# Altium schematic sheet Logic_SE.SchDoc
size A
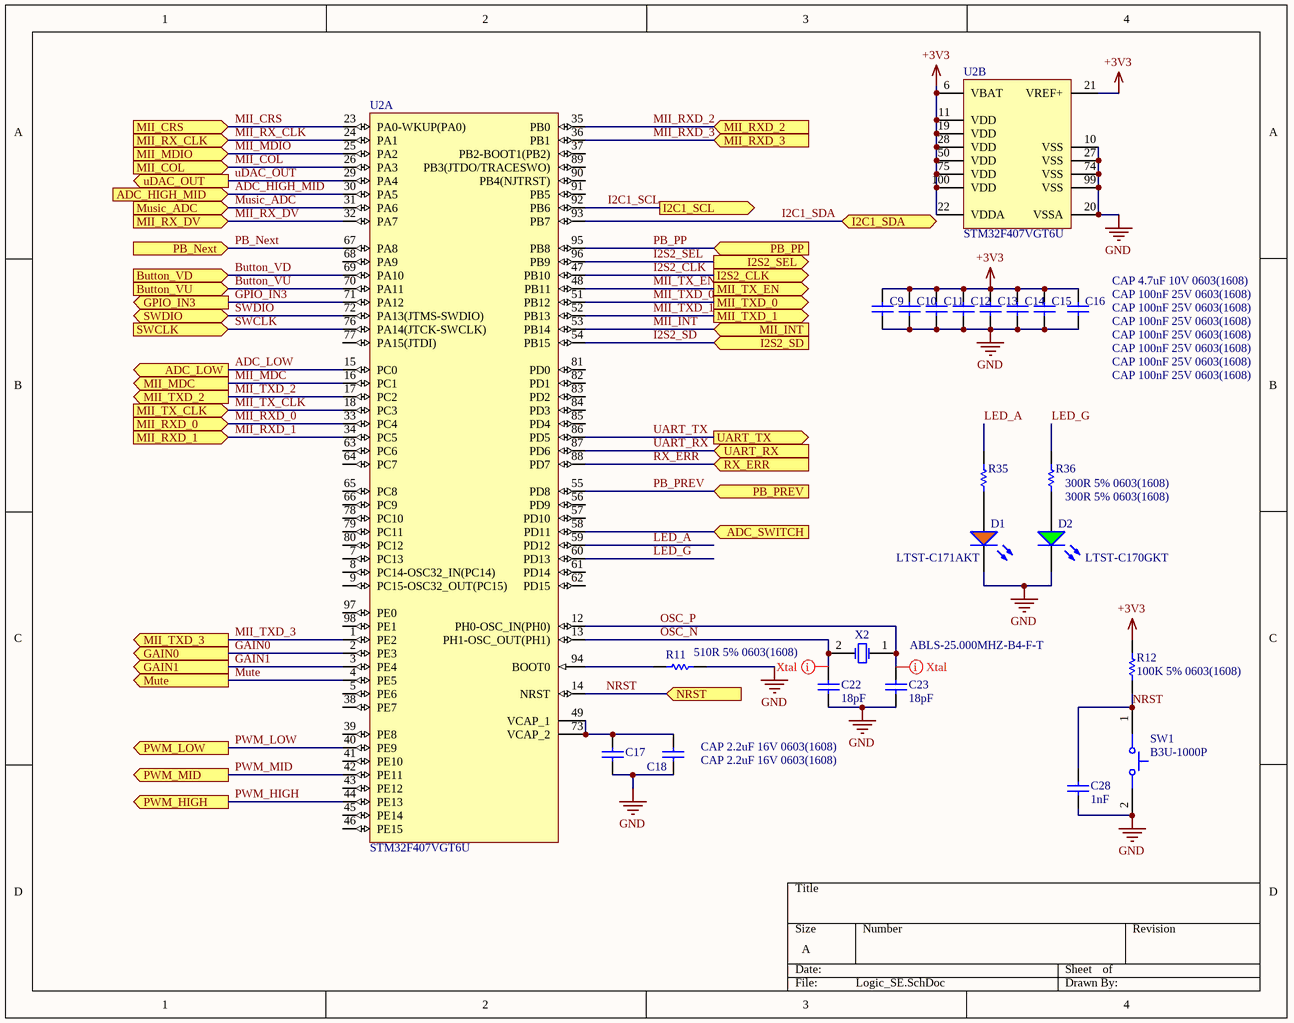
[diagram p0: Logic_SE.SchDoc]

## Parts
C9  CAP 100nF 25V 0603(1608)  [CAPC0603(1608)100_N]
C10  CAP 100nF 25V 0603(1608)  [CAPC0603(1608)100_N]
C11  CAP 100nF 25V 0603(1608)  [CAPC0603(1608)100_N]
C12  CAP 100nF 25V 0603(1608)  [CAPC0603(1608)100_N]
C13  CAP 100nF 25V 0603(1608)  [CAPC0603(1608)100_N]
C14  CAP 100nF 25V 0603(1608)  [CAPC0603(1608)100_N]
C15  CAP 100nF 25V 0603(1608)  [CAPC0603(1608)100_N]
C16  CAP 4.7uF 10V 0603(1608)  [CAPC0603(1608)100_M]
C17  CAP 2.2uF 16V 0603(1608)  [CAPC0603(1608)55_L]
C18  CAP 2.2uF 16V 0603(1608)  [CAPC0603(1608)55_L]
C22  18pF  [CAPC0603(1608)100_L]
C23  18pF  [CAPC0603(1608)100_L]
C28  1nF  [CAPC0603(1608)100_L]
D1  LTST-C171AKT  [LTST-C171AKT_V]
D2  LTST-C170GKT  [LTST-C170GKT_V]
R11  510R 5% 0603(1608)  [RESC0603(1608)_L]
R12  100K 5% 0603(1608)  [RESC0603(1608)_N]
R35  300R 5% 0603(1608)  [RESC0603(1608)_N]
R36  300R 5% 0603(1608)  [RESC0603(1608)_N]
SW1  B3U-1000P  [OMRON-B3U-1000_V]
U2  STM32F407VGT6U  [STM-LQFP100_V]  (parts A,B of 2)
X2  ABLS-25.000MHZ-B4-F-T  [ABRA-ABLS2-2_V]

## Ports
ADC_HIGH_MID (in), ADC_LOW (out), ADC_SWITCH (in), Button_VD (in), Button_VU (in), GAIN0 (out), GAIN1 (out), GPIO_IN3 (out), I2C1_SCL (out), I2C1_SDA (bidir), I2S2_CLK (out), I2S2_SD (in), I2S2_SEL (out), MII_COL (in), MII_CRS (in), MII_INT (in), MII_MDC (out), MII_MDIO (in), MII_RX_CLK (in), MII_RX_DV (in), MII_RXD_0 (in), MII_RXD_1 (in), MII_RXD_2 (in), MII_RXD_3 (in), MII_TX_CLK (in), MII_TX_EN (out), MII_TXD_0 (out), MII_TXD_1 (out), MII_TXD_2 (out), MII_TXD_3 (out), Music_ADC (in), Mute (out), NRST (in), PB_Next (in), PB_PP (in), PB_PREV (in), PWM_HIGH (out), PWM_LOW (out), PWM_MID (out), RX_ERR (in), SWCLK (in), SWDIO (bidir), UART_RX (in), UART_TX (out), uDAC_OUT (out)

## Nets
+3V3: C9.2 C10.2 C11.2 C12.2 C13.2 C14.2 C15.2 C16.2 R12.2 U2.6(VBAT) U2.11(VDD) U2.19(VDD) U2.21(VREF+) U2.22(VDDA) U2.28(VDD) U2.50(VDD) U2.75(VDD) U2.100(VDD)
GND: C9.1 C10.1 C11.1 C12.1 C13.1 C14.1 C15.1 C16.1 C17.1 C18.1 C22.1 C23.1 C28.1 D1.C D2.C R11.2 SW1.2 U2.10(VSS) U2.20(VSSA) U2.27(VSS) U2.74(VSS) U2.99(VSS)
ADC_HIGH_MID: U2.30(PA5) ; port ADC_HIGH_MID
ADC_LOW: U2.15(PC0) ; port ADC_LOW
ADC_SWITCH: U2.58(PD11) ; port ADC_SWITCH
Button_VD: U2.69(PA10) ; port Button_VD
Button_VU: U2.70(PA11) ; port Button_VU
GAIN0: U2.2(PE3) ; port GAIN0
GAIN1: U2.3(PE4) ; port GAIN1
GPIO_IN3: U2.71(PA12) ; port GPIO_IN3
I2C1_SCL: U2.92(PB6) ; port I2C1_SCL
I2C1_SDA: U2.93(PB7) ; port I2C1_SDA
I2S2_CLK: U2.47(PB10) ; port I2S2_CLK
I2S2_SD: U2.54(PB15) ; port I2S2_SD
I2S2_SEL: U2.96(PB9) ; port I2S2_SEL
LED_A: R35.2 U2.59(PD12)
LED_G: R36.2 U2.60(PD13)
MII_COL: U2.26(PA3) ; port MII_COL
MII_CRS: U2.23(PA0-WKUP(PA0)) ; port MII_CRS
MII_INT: U2.53(PB14) ; port MII_INT
MII_MDC: U2.16(PC1) ; port MII_MDC
MII_MDIO: U2.25(PA2) ; port MII_MDIO
MII_RX_CLK: U2.24(PA1) ; port MII_RX_CLK
MII_RX_DV: U2.32(PA7) ; port MII_RX_DV
MII_RXD_0: U2.33(PC4) ; port MII_RXD_0
MII_RXD_1: U2.34(PC5) ; port MII_RXD_1
MII_RXD_2: U2.35(PB0) ; port MII_RXD_2
MII_RXD_3: U2.36(PB1) ; port MII_RXD_3
MII_TX_CLK: U2.18(PC3) ; port MII_TX_CLK
MII_TX_EN: U2.48(PB11) ; port MII_TX_EN
MII_TXD_0: U2.51(PB12) ; port MII_TXD_0
MII_TXD_1: U2.52(PB13) ; port MII_TXD_1
MII_TXD_2: U2.17(PC2) ; port MII_TXD_2
MII_TXD_3: U2.1(PE2) ; port MII_TXD_3
Music_ADC: U2.31(PA6) ; port Music_ADC
Mute: U2.4(PE5) ; port Mute
NRST: C28.2 R12.1 SW1.1 U2.14(NRST) ; port NRST
OSC_N: C22.2 U2.13(PH1-OSC_OUT(PH1)) X2.2(X2)
OSC_P: C23.2 U2.12(PH0-OSC_IN(PH0)) X2.1(X1)
PB_Next: U2.67(PA8) ; port PB_Next
PB_PP: U2.95(PB8) ; port PB_PP
PB_PREV: U2.55(PD8) ; port PB_PREV
PWM_HIGH: U2.44(PE13) ; port PWM_HIGH
PWM_LOW: U2.40(PE9) ; port PWM_LOW
PWM_MID: U2.42(PE11) ; port PWM_MID
RX_ERR: U2.88(PD7) ; port RX_ERR
SWCLK: U2.76(PA14(JTCK-SWCLK)) ; port SWCLK
SWDIO: U2.72(PA13(JTMS-SWDIO)) ; port SWDIO
UART_RX: U2.87(PD6) ; port UART_RX
UART_TX: U2.86(PD5) ; port UART_TX
uDAC_OUT: U2.29(PA4) ; port uDAC_OUT
NetC17_2: C17.2 C18.2 U2.49(VCAP_1) U2.73(VCAP_2)
NetD1_A: D1.A R35.1
NetD2_A: D2.A R36.1
NetR11_1: R11.1 U2.94(BOOT0)

Not connected (* = marked no-connect by the designer): U2 5(PE6) 7(PC13) 8(PC14-OSC32_IN(PC14)) 9(PC15-OSC32_OUT(PC15)) 37(PB2-BOOT1(PB2)) 38(PE7) 39(PE8) 41(PE10) 43(PE12) 45(PE14) 46(PE15) 56(PD9) 57(PD10) 61(PD14) 62(PD15) 63(PC6) 64(PC7) 65(PC8) 66(PC9) 68(PA9) 77(PA15(JTDI)) 78(PC10) 79(PC11) 80(PC12) 81(PD0) 82(PD1) 83(PD2) 84(PD3) 85(PD4) 89(PB3(JTDO/TRACESWO)) 90(PB4(NJTRST)) 91(PB5) 97(PE0) 98(PE1)

## Layout directives
net class Xtal: OSC_N, OSC_P

## Library data of the parts
C9-C15 = CMP-1035-02589-1: CAP 100nF 25V ±20% 0603 (1608 Metric) Thickness 1mm SMD; Case-EIA: 0603; Tolerance: Â±20%; Case-Metric: 1608; Value: 100nF; Max Thickness: 1 mm; Technology: SMT; Rated Voltage: 25 V
C16 = CMP-1035-02787-1: CAP 4.7uF 10V ±20% 0603 (1608 Metric) Thickness 1mm SMD; Case-EIA: 0603; Case-Metric: 1608; Tolerance: Â±20%; Value: 4.7uF; Max Thickness: 1 mm; Technology: SMT; Rated Voltage: 10 V
C17 C18 = CMP-1035-02764-1: CAP 2.2uF 16V ±20% 0603 (1608 Metric) Thickness 0.55mm SMD; Tolerance: Â±20%; Case-Metric: 1608; Case-EIA: 0603; Value: 2.2uF; Rated Voltage: 16 V; Max Thickness: 0.55 mm; Technology: SMT
C22 C23 C28 = CMP-1590-00005-1: 0603 (1608 Metric) Chip Capacitor; Case-Metric: 1608; Case-EIA: 0603; PackageReference: CAPC0603(1608)100
D1 = CMP-1674-00004-3: LED AMBER CLR THIN 0805 SMD; Manufacturer: Lite-On; PartNumber: LTST-C171AKT; ComponentLink1URL: http://optoelectronics.liteon.com/upload/download/DS-22-99-0170/S_110_LTST-C171AKT.pdf; PackageReference: C171AKT; ComponentLink1Description: Datasheet
D2 = CMP-1674-00002-2: LED GREEN CLEAR 0805 SMD; ComponentLink1Description: Datasheet; PackageReference: C170GKT; ComponentLink1URL: http://media.digikey.com/pdf/Data%20Sheets/Lite-On%20PDFs/LTST-C170GKT.pdf; PartNumber: LTST-C170GKT
R11 = CMP-1012-00067-1: 510R 0.1W 5% 0603 (1608 Metric)  SMD; Case-EIA: 0603; Value: 510.00 Ohm; Case-Metric: 1608; Technology: SMT; Power: 0.1 W; Tolerance: 5 %
R12 R35 R36 = CMP-1012-00122-1: 100K 0.1W 5% 0603 (1608 Metric)  SMD; Case-EIA: 0603; Value: 100000.00 Ohm; Case-Metric: 1608; Tolerance: 5 %; Power: 0.1 W; Technology: SMT
SW1 = CMP-2100-03586-1: Ultra-Small Tactile Switch, 0.05 A, 12 V, -25 to 70 degC, 2-Pin SMD, RoHS, Tape and Reel; Manufacturer: Omron Electronic Components; Operating Force: 1.5N; Current Rating: 50mA; Voltage Rating (DC): 12V; Electrical Life: 200000Cycles; Actuator Length: 0.4mm; Insulation Resistance: 100MOhm; Switch Travel: 0.15mm; Throw Configuration: SPST; Illumination Type: Illuminated; Width: 3mm; Weight: 0.022g; Datasheet Version: 42005.0; Datasheet URL: http://www.omron.com/ecb/products/pdf/en-b3u.pdf; Height: 1.2mm; Package Quantity: 1; REACH SVHC: Unknown; Contact Current Rating: 50mA; Contact Material: Silver; Max Current Rating: 50mA; Package Reference: B3U-1000; Termination: SMD/SMT; Packaging: TapeandReel; Manufacturer URL: http://www.omron.com/; RoHSCompliant: true; Mount: SurfaceMount; Length: 4mm; Min Operating Temperature: -25degC; Depth: 2.5mm; Lead Free: LeadFree; Case/Package: SMD/SMT; Package Description: 2-Pin Surface Mount Device, Body 3 x 2.5 mm; Max Operating Temperature: 70degC; Orientation: Straight
U2 = CMP-0243-00032-2: ARM Cortex-M4 32-bit MCU+FPU, 210 DMIPS, 1024 kB Flash, 192 kB Internal RAM, 82 I/Os, 100-pin LQFP, -40 to 85 degC, Tray; Manufacturer: STMicroelectronics; D/A Converter: 2x12-bit; Supply Voltage(Vcc) min (V): 1.8; Internal RAM Size (kB): 192; I/Os (High Current): 82; FLASH Size (Prog) (kB): 1024; Supply Voltage(Vcc) max (V): 3.6; Operating Frequency(F) (Processor speed) (MHz): 168; ComponentLink3Description: Package Specification; Mounting Technology: Surface Mount; Core: ARM Cortex-M4; PartNumber: STM32F407VGT6U; PackageDescription: 100-Pin Low Profile Quad Flat Package, 14 x 14 mm Body, 0.5 mm Pitch; PackageReference: LQFP100; ComponentLink1URL: http://www.st.com/web/en/home.html; ComponentLink2Description: Datasheet; Packing: Tray; ComponentLink2URL: http://www.st.com/st-web-ui/static/active/en/resource/technical/document/datasheet/DM00037051.pdf; PackageVersion: Rev. 1, 06/2013; ComponentLink3URL: http://www.st.com/st-web-ui/static/active/en/resource/technical/document/data_brief/DM00071938.pdf; DatasheetVersion: Rev. 4; ComponentLink1Description: Manufacturer URL; PartId: 1
X2 = CMP-0277-00002-1: Low Profile Surface Mount Microprocessor Crystal, 25 MHz +/-30 ppm, 180 Ohm, -40 to 85 degC, 2-Pin 11.4 x 4.7 x 3.3 mm SMD, RoHS, Tape and Reel; Manufacturer: Abracon; PartNumber: ABLS2-4.096MHZ-D4Y-T; Operation Mode: Fundamental or 3rd Overtone; Shunt Capacitance: 7 pF Max.; ESR: 180 Ohm; Load Capacitance: 18 pF; Frequency: 4.096 MHz; Mounting Technology: Surface Mount; PackageDescription: 2-Pin SMD, Body 11.4 x 4.7 mm, Height 3.3 mm; ComponentLink1URL: http://www.abracon.com/; Freq. Stability: +/- 30 ppm; ComponentLink2Description: Datasheet; Operating Temp. Range: -40 to 85 degC; Packing: Tape and Reel; RoHS: TRUE; PackageReference: ABLS2-2; DatasheetVersion: Rev. 03.31.11; Freq. Tolerance: +/- 30 ppm; ComponentLink2URL: http://www.abracon.com/Resonators/ABLS2.pdf; ComponentLink1Description: Manufacturer URL